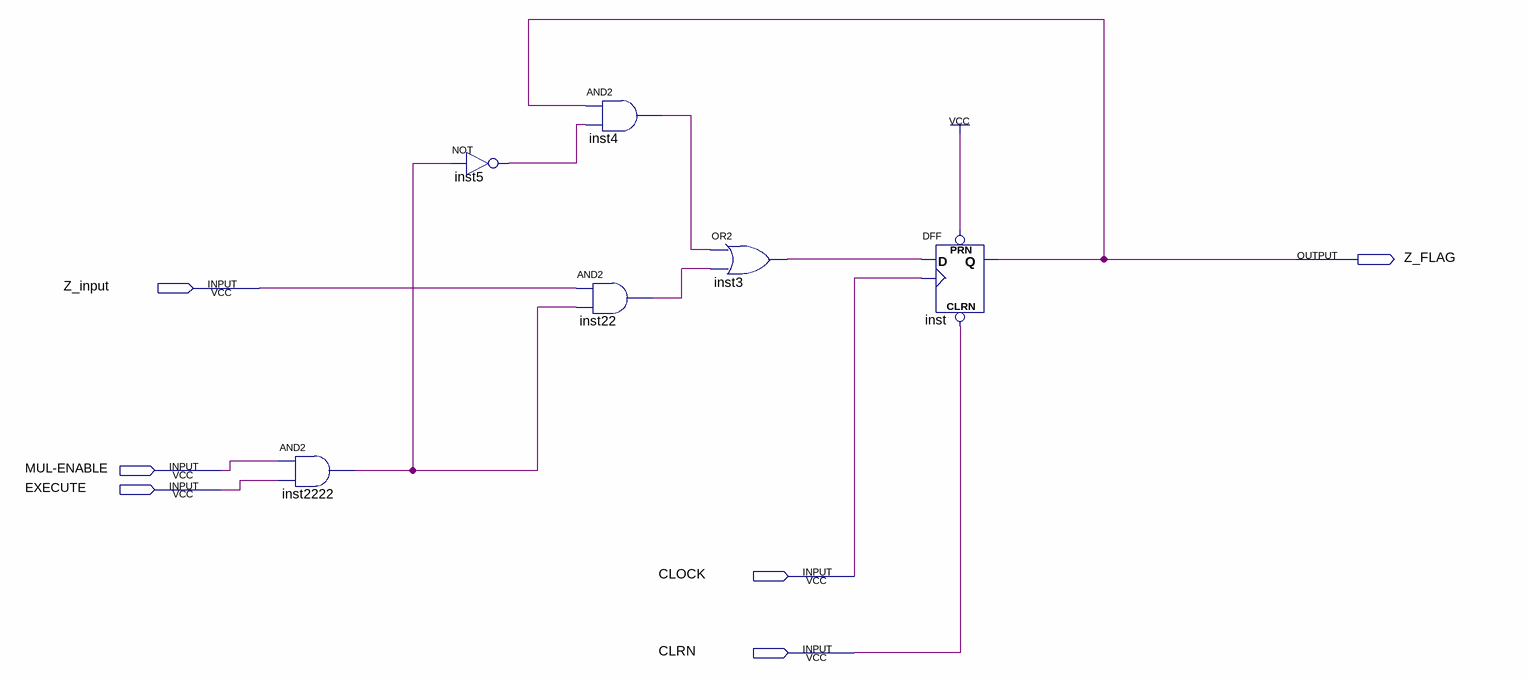
[diagram p0: schematic sheet]
// Quartus schematic ZEROLOGIC.bdf as structural Verilog: 6 symbols, 6 pins
module ZEROLOGIC (
  input  Z_input,
  input  \MUL-ENABLE ,
  input  EXECUTE,
  input  CLOCK,
  input  CLRN,
  output Z_FLAG
);

  wire inst3_out, inst4_out, inst5_out, inst22_out, inst2222_out;

  and inst2222 (inst2222_out, \MUL-ENABLE , EXECUTE);
  not inst5 (inst5_out, inst2222_out);
  and inst4 (inst4_out, Z_FLAG, inst5_out);
  and inst22 (inst22_out, Z_input, inst2222_out);
  or inst3 (inst3_out, inst4_out, inst22_out);
  DFF inst (.CLRN(CLRN), .CLK(CLOCK), .D(inst3_out), .PRN(1'b1), .Q(Z_FLAG));
endmodule
